# Altium schematic sheet processing.SchDoc: FPGA Cluster
size Legal; CheckedBy: J. Brinton; CompanyName: Signal Laboratories, Inc.; DrawnBy: J. Brinton; Engineer: J. Brinton; Address1: 3479 Edison Way; Address2: Menlo Park CA 94025; Address3: +1 (877) 778-8435; Address4: siglabs.com; DocumentNumber: 10; Revision: 2b; SheetNumber: 11; SheetTotal: 58
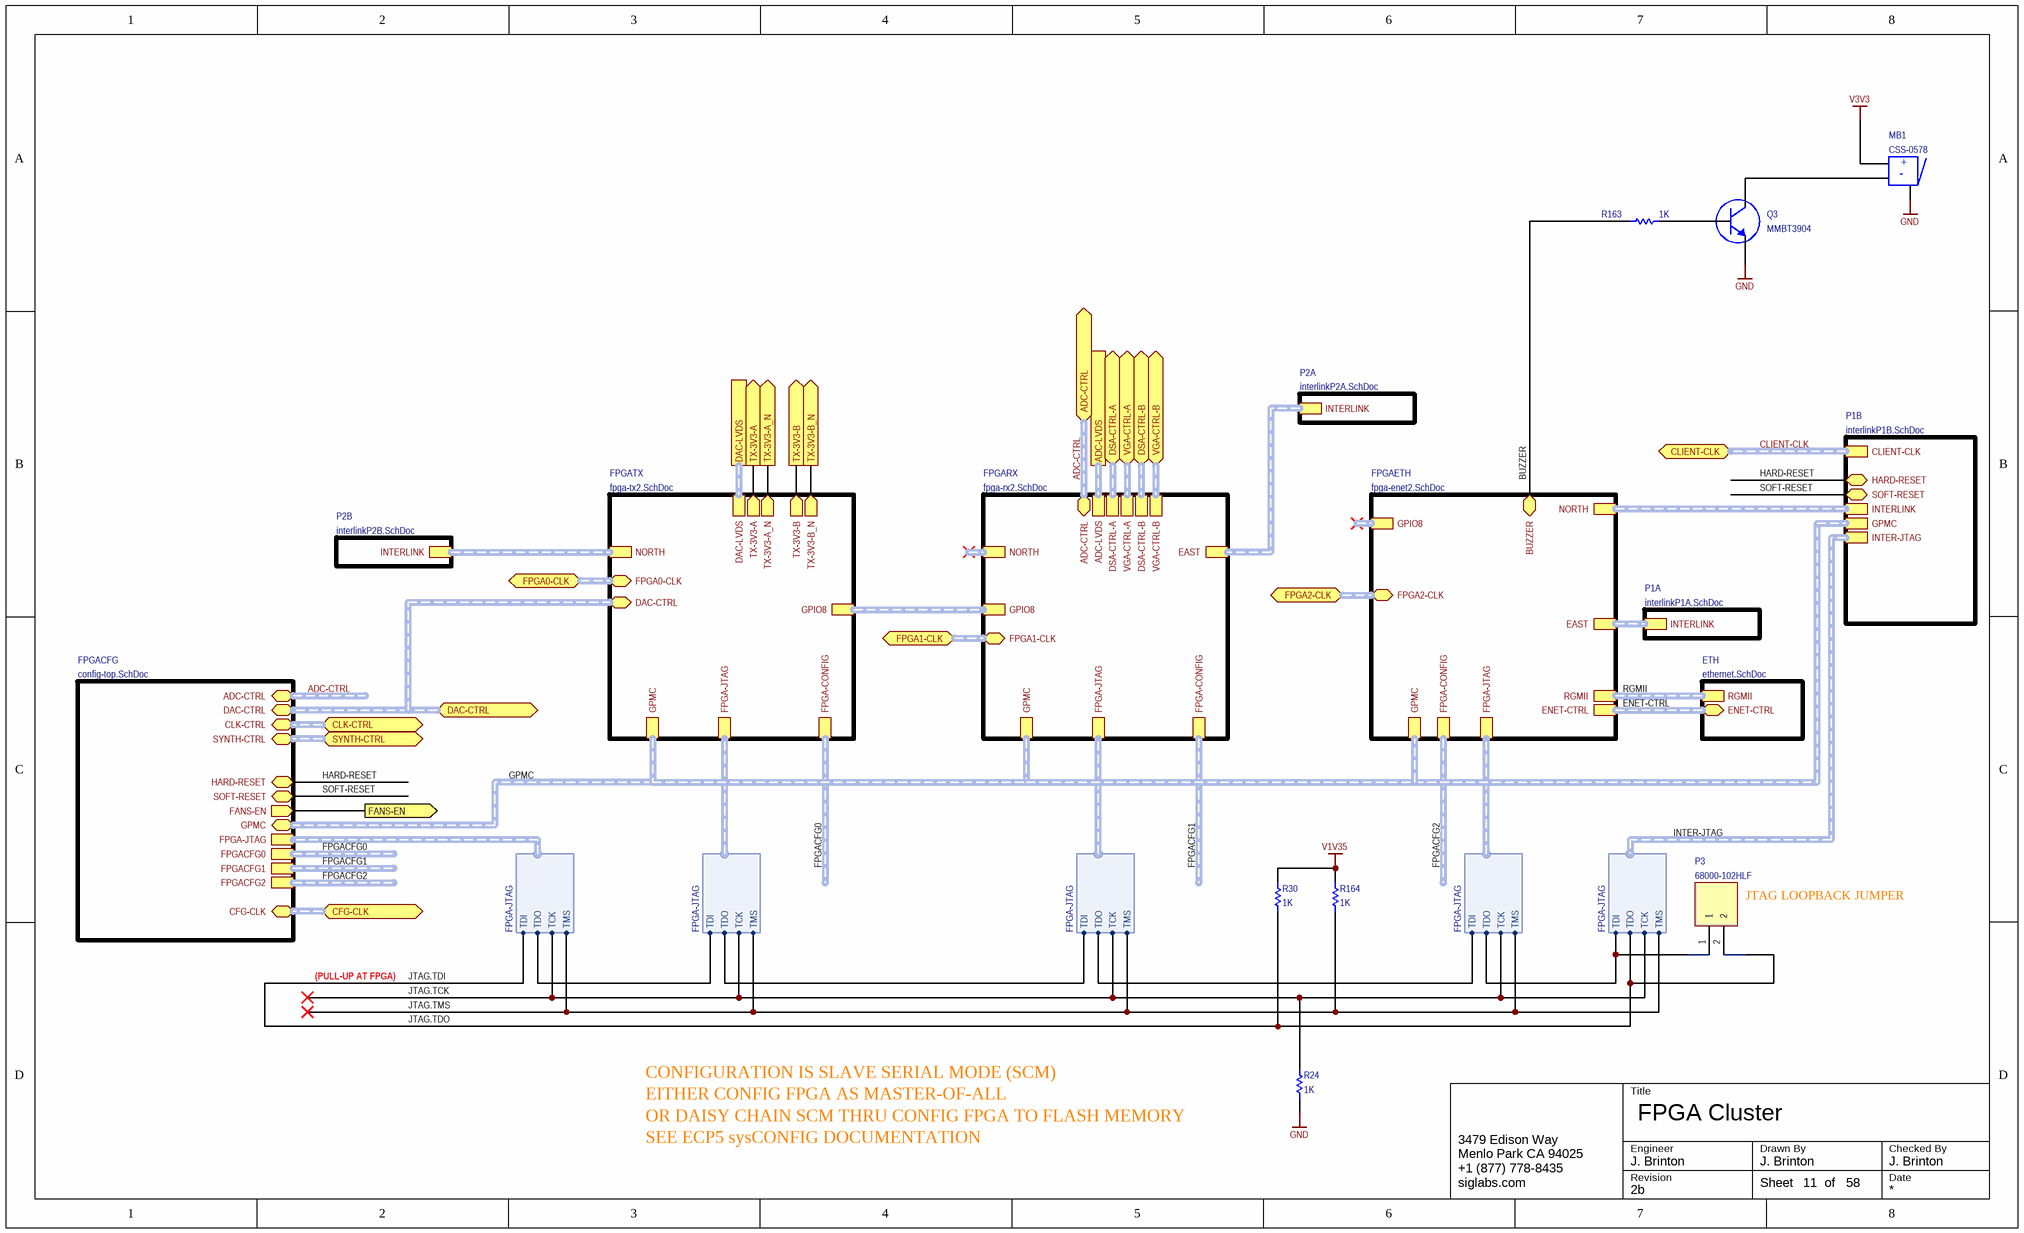
[diagram p0: processing.SchDoc]

## Parts
MB1  CSS-0578  [CSS-0578]
P3  68000-102HLF  [68000-102HLF]
Q3  MMBT3904  [SOT23]
R24  value 1K  [0402]  (hidden comment: ERJ-2RKF1001X)
R30  value 1K  [0402]  (hidden comment: ERJ-2RKF1001X)
R163  value 1K  [0402]  (hidden comment: RC0402FR-071KL)
R164  value 1K  [0402]  (hidden comment: ERJ-2RKF1001X)

## Sub-sheets
ETH = ethernet.SchDoc: RGMII (harness RGMII), ENET-CTRL (harness ENET-CTRL)
FPGACFG = config-top.SchDoc: FPGACFG0 (harness CONF_1V5), FPGACFG1 (harness CONF_1V5), FPGACFG2 (harness CONF_1V5), FPGA-JTAG (harness FPGA-JTAG), GPMC (harness GPMC), DAC-CTRL (harness DAC-CTRL), CLK-CTRL (harness CLK-CTRL), SYNTH-CTRL (harness SYNTH-CTRL), SOFT-RESET, HARD-RESET, CFG-CLK (harness CLK-LVPECL33), ADC-CTRL (harness ADC-CTRL-1V8), FANS-EN (out)
FPGAETH = fpga-enet2.SchDoc: RGMII (harness RGMII), FPGA-CONFIG (harness CONF_1V5), ENET-CTRL (harness ENET-CTRL), NORTH (harness INTERLINK), EAST (harness INTERLINK), GPMC (harness GPMC), GPIO8 (harness GPIO8), FPGA-JTAG (harness FPGA-JTAG), BUZZER, FPGA2-CLK (harness CLK-LVPECL33)
FPGARX = fpga-rx2.SchDoc: FPGA-CONFIG (harness CONF_1V5), NORTH (harness INTERLINK), EAST (harness INTERLINK), GPMC (harness GPMC), GPIO8 (harness GPIO8), FPGA-JTAG (harness FPGA-JTAG), ADC-LVDS (harness ADC-LVDS), DSA-CTRL-A (harness DSA_CTRL), VGA-CTRL-A (harness SPI), DSA-CTRL-B (harness DSA_CTRL), VGA-CTRL-B (harness SPI), FPGA1-CLK (harness CLK-LVPECL33), ADC-CTRL (harness ADC-CTRL-1V8)
FPGATX = fpga-tx2.SchDoc: FPGA-CONFIG (harness CONF_1V5), NORTH (harness INTERLINK), GPMC (harness GPMC), GPIO8 (harness GPIO8), FPGA-JTAG (harness FPGA-JTAG), DAC-LVDS (harness DAC-LVDS), TX-3V3-A (out), TX-3V3-B (out), FPGA0-CLK (harness CLK-LVPECL33), DAC-CTRL (harness DAC-CTRL), TX-3V3-A_N (out), TX-3V3-B_N (out)
P1A = interlinkP1A.SchDoc: INTERLINK (harness INTERLINK)
P1B = interlinkP1B.SchDoc: INTERLINK (harness INTERLINK), GPMC (harness GPMC), INTER-JTAG (harness FPGA-JTAG), SOFT-RESET, HARD-RESET, CLIENT-CLK (harness CLK-LVPECL33)
P2A = interlinkP2A.SchDoc: INTERLINK (harness INTERLINK)
P2B = interlinkP2B.SchDoc: INTERLINK (harness INTERLINK)

## Ports
ADC-CTRL (harness ADC-CTRL-1V8), ADC-LVDS (harness ADC-LVDS), CFG-CLK (harness CLK-LVPECL33), CLIENT-CLK (harness CLK-LVPECL33), CLK-CTRL (harness CLK-CTRL), DAC-CTRL (harness DAC-CTRL), DAC-LVDS (harness DAC-LVDS), DSA-CTRL-A (harness DSA_CTRL), DSA-CTRL-B (harness DSA_CTRL), FANS-EN (out), FPGA0-CLK (harness CLK-LVPECL33), FPGA1-CLK (harness CLK-LVPECL33), FPGA2-CLK (harness CLK-LVPECL33), SYNTH-CTRL (harness SYNTH-CTRL), TX-3V3-A (out), TX-3V3-A_N (out), TX-3V3-B (out), TX-3V3-B_N (out), VGA-CTRL-A (harness SPI), VGA-CTRL-B (harness SPI)

## Harnesses
FPGA-JTAG: TCK, TDI, TDO, TMS

## Nets
GND: MB1.3(TAB) Q3.2(E) R24.2
V1V35: R30.2 R164.2
V3V3: MB1.1(POS)
BUZZER: R163.2 ; sheet FPGAETH/BUZZER
FANS-EN: port FANS-EN, sheet FPGACFG/FANS-EN
HARD-RESET: sheet FPGACFG/HARD-RESET, sheet P1B/HARD-RESET
INTER-JTAG.TDI: P3.1 ; sheet FPGAETH/FPGA-JTAG.TDO, sheet P1B/INTER-JTAG.TDI
JTAG.TCK: R24.1 ; sheet FPGATX/FPGA-JTAG.TCK, sheet FPGARX/FPGA-JTAG.TCK, sheet FPGAETH/FPGA-JTAG.TCK, sheet FPGACFG/FPGA-JTAG.TCK, sheet P1B/INTER-JTAG.TCK  [project net INTER-JTAG.TCK]
JTAG.TDI: P3.2 R30.1 ; sheet FPGACFG/FPGA-JTAG.TDI, sheet P1B/INTER-JTAG.TDO  [also labelled JTAG.TDO]  [project net INTER-JTAG.TDO]
JTAG.TMS: R164.1 ; sheet FPGATX/FPGA-JTAG.TMS, sheet FPGARX/FPGA-JTAG.TMS, sheet FPGAETH/FPGA-JTAG.TMS, sheet FPGACFG/FPGA-JTAG.TMS, sheet P1B/INTER-JTAG.TMS  [project net INTER-JTAG.TMS]
SOFT-RESET: sheet FPGACFG/SOFT-RESET, sheet P1B/SOFT-RESET
TX-3V3-A: port TX-3V3-A, sheet FPGATX/TX-3V3-A
TX-3V3-A_N: port TX-3V3-A_N, sheet FPGATX/TX-3V3-A_N
TX-3V3-B: port TX-3V3-B, sheet FPGATX/TX-3V3-B
TX-3V3-B_N: port TX-3V3-B_N, sheet FPGATX/TX-3V3-B_N
NetMB1_2: MB1.2(NEG) Q3.3(C)
NetQ3_1: Q3.1(B) R163.1
(unnamed): sheet FPGATX/FPGA-JTAG.TDI, sheet FPGACFG/FPGA-JTAG.TDO
(unnamed): sheet FPGATX/FPGA-JTAG.TDO, sheet FPGARX/FPGA-JTAG.TDI
(unnamed): sheet FPGARX/FPGA-JTAG.TDO, sheet FPGAETH/FPGA-JTAG.TDI

## Buses and harness runs
harness ADC-CTRL = port ADC-CTRL = sheet FPGARX/ADC-CTRL
harness ADC-CTRL = sheet FPGACFG/ADC-CTRL
harness CLIENT-CLK = port CLIENT-CLK = sheet P1B/CLIENT-CLK
harness ENET-CTRL = sheet ETH/ENET-CTRL = sheet FPGAETH/ENET-CTRL
harness FPGACFG0 = sheet FPGACFG/FPGACFG0
harness FPGACFG0 = sheet FPGATX/FPGA-CONFIG
harness FPGACFG1 = sheet FPGACFG/FPGACFG1
harness FPGACFG1 = sheet FPGARX/FPGA-CONFIG
harness FPGACFG2 = sheet FPGACFG/FPGACFG2
harness FPGACFG2 = sheet FPGAETH/FPGA-CONFIG
harness GPMC = sheet FPGACFG/GPMC = sheet FPGAETH/GPMC = sheet FPGARX/GPMC = sheet FPGATX/GPMC = sheet P1B/GPMC
harness INTER-JTAG = sheet P1B/INTER-JTAG
harness port ADC-LVDS = sheet FPGARX/ADC-LVDS
harness port CFG-CLK = sheet FPGACFG/CFG-CLK
harness port CLK-CTRL = sheet FPGACFG/CLK-CTRL
harness port DAC-CTRL = sheet FPGACFG/DAC-CTRL = sheet FPGATX/DAC-CTRL
harness port DAC-LVDS = sheet FPGATX/DAC-LVDS
harness port DSA-CTRL-A = sheet FPGARX/DSA-CTRL-A
harness port DSA-CTRL-B = sheet FPGARX/DSA-CTRL-B
harness port FPGA0-CLK = sheet FPGATX/FPGA0-CLK
harness port FPGA1-CLK = sheet FPGARX/FPGA1-CLK
harness port FPGA2-CLK = sheet FPGAETH/FPGA2-CLK
harness port SYNTH-CTRL = sheet FPGACFG/SYNTH-CTRL
harness port VGA-CTRL-A = sheet FPGARX/VGA-CTRL-A
harness port VGA-CTRL-B = sheet FPGARX/VGA-CTRL-B
harness RGMII = sheet ETH/RGMII = sheet FPGAETH/RGMII
harness sheet FPGAETH/EAST = sheet P1A/INTERLINK
harness sheet FPGAETH/NORTH = sheet P1B/INTERLINK
harness sheet FPGARX/EAST = sheet P2A/INTERLINK
harness sheet FPGARX/GPIO8 = sheet FPGATX/GPIO8
harness sheet FPGATX/NORTH = sheet P2B/INTERLINK

## Notes on the sheet
- (near P3) JTAG LOOPBACK JUMPER
- (PULL-UP AT FPGA)
- CONFIGURATION IS SLAVE SERIAL MODE (SCM)
- EITHER CONFIG FPGA AS MASTER-OF-ALL
- OR DAISY CHAIN SCM THRU CONFIG FPGA TO FLASH MEMORY
- SEE ECP5 sysCONFIG DOCUMENTATION
- Title
- Engineer
- Revision
- Drawn By
- Checked By
- Date
- Sheet
- of
- (in symbol CSS-0578) +; -

## Library data of the parts
MB1 = CSS-0578: Magnetic Buzzer; Manufacturer: CUI, Inc.; Manufacturer P/N: CSS-0578
P3 = 68000-102HLF: Connector; Header; 2 Position; 0.1" Pitch; Manufacturer: FCI; Manufacturer P/N: 68000-102HLF
Q3 = 2N3904: NPN General Purpose Amplifier; Manufacturer: Fairchild Semiconductor; Manufacturer P/N: MMBT3904
R24 R30 R164 = RES 0402: Thick Film Resistor 1k ±1% 0402; Manufacturer: Yageo; Manufacturer P/N: RC0402FR-071KL; Tr: -55:155; Package: 0402; Tolerance: ±1%
R163 = RES 0402: Thick Film Resistor 1k ±1% 0402; Manufacturer: Yageo; Tr: -55:155; Package: 0402; Manufacturer P/N: RC0402FR-071KL; Tolerance: ±1%